# Altium schematic sheet MainSchem.SchDoc
size Tabloid
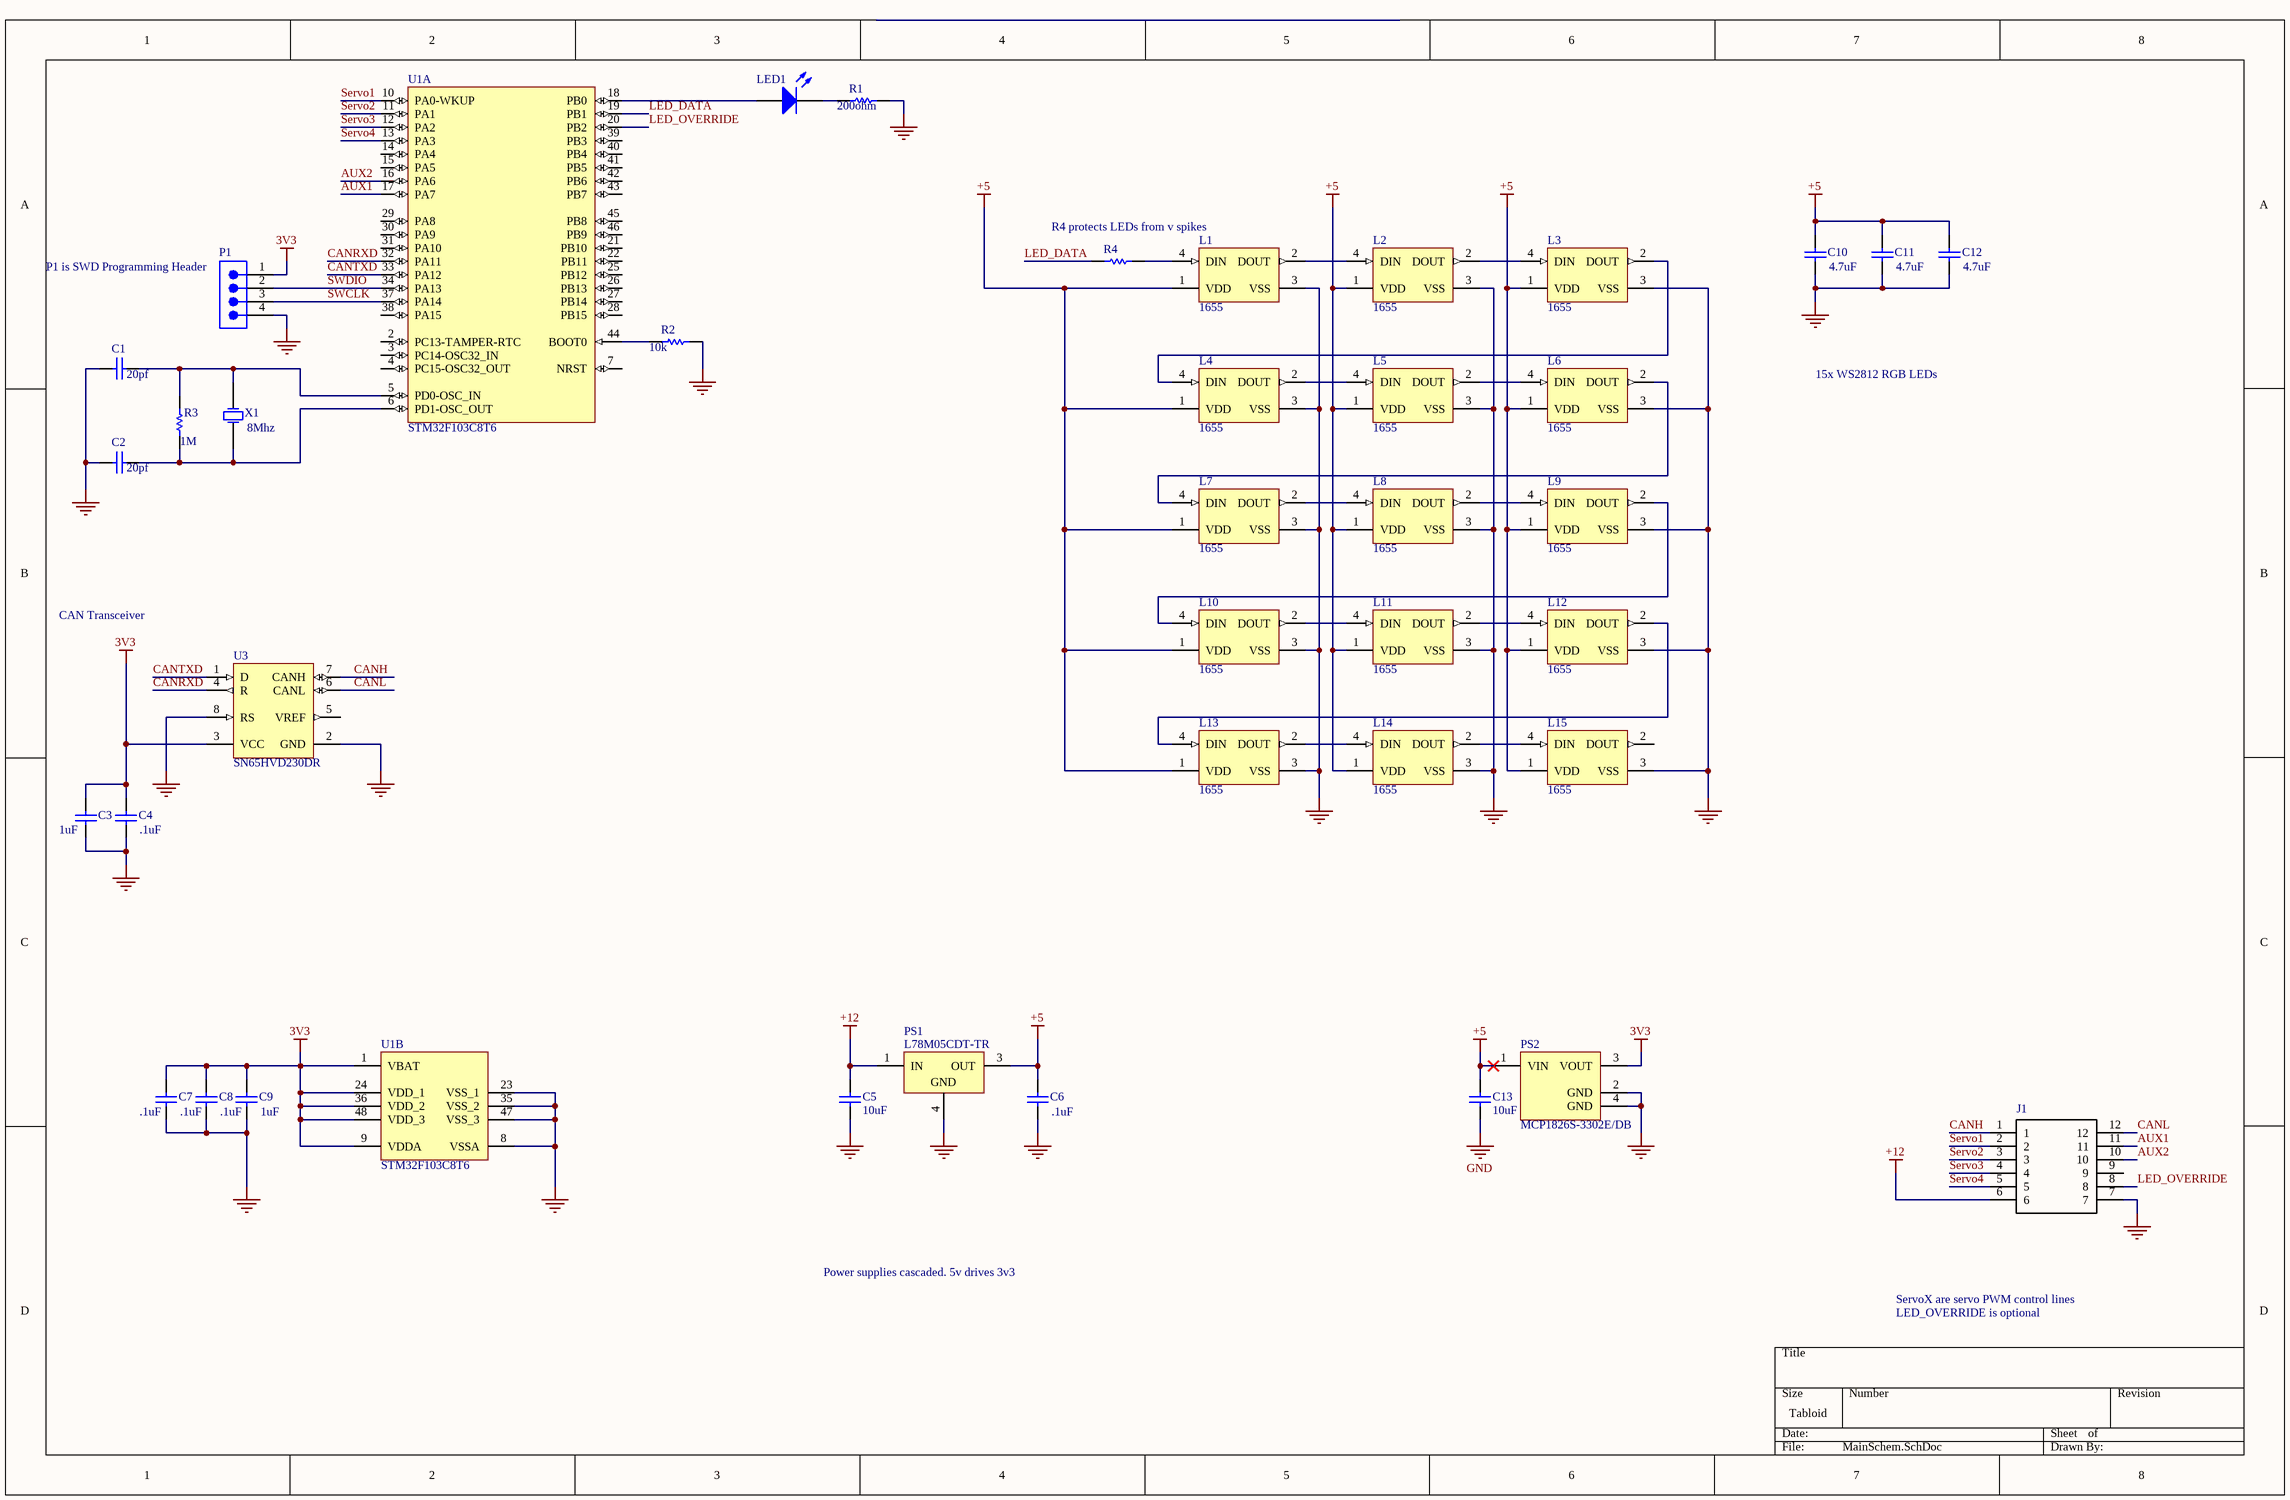
[diagram p0: MainSchem.SchDoc]

## Parts
C1  08051A200JAT2A  [CAPC2013X140X50NL20T25]  (value not drawn)
C2  08051A200JAT2A  [CAPC2013X140X50NL20T25]  (value not drawn)
C3  GRM31MR71H105KA88L  [CAPC3216X125X55LL15T25]  (value not drawn)
C4  12065C104KAT2A  [CAPC3216X94X50ML20T25]  (value not drawn)
C5  10uF  [MURA-1206_H_1.8_M]
C6  12065C104KAT2A  [CAPC3216X94X50ML20T25]  (value not drawn)
C7  12065C104KAT2A  [CAPC3216X94X50ML20T25]  (value not drawn)
C8  12065C104KAT2A  [CAPC3216X94X50ML20T25]  (value not drawn)
C9  12065C104KAT2A  [CAPC3216X94X50ML20T25]  (value not drawn)
C10  CGA6M3X7S2A475K200AB  [CAPC3225X220X20LL40]  (value not drawn)
C11  CGA6M3X7S2A475K200AB  [CAPC3225X220X20LL40]  (value not drawn)
C12  CGA6M3X7S2A475K200AB  [CAPC3225X220X20LL40]  (value not drawn)
C13  10uF  [MURA-1206_H_1.8_M]
J1  DTM13-12PA  [*TE_DTM13-12PA]  (value not drawn)
L1  1655  [ADA-RGB-1655_V]
L2  1655  [ADA-RGB-1655_V]
L3  1655  [ADA-RGB-1655_V]
L4  1655  [ADA-RGB-1655_V]
L5  1655  [ADA-RGB-1655_V]
L6  1655  [ADA-RGB-1655_V]
L7  1655  [ADA-RGB-1655_V]
L8  1655  [ADA-RGB-1655_V]
L9  1655  [ADA-RGB-1655_V]
L10  1655  [ADA-RGB-1655_V]
L11  1655  [ADA-RGB-1655_V]
L12  1655  [ADA-RGB-1655_V]
L13  1655  [ADA-RGB-1655_V]
L14  1655  [ADA-RGB-1655_V]
L15  1655  [ADA-RGB-1655_V]
LED1  150120GS75000  [1206_A]  (value not drawn)
P1  TSW-104-08-G-S  [SMTC-TSW-104-08-X-S]  (value not drawn)
PS1  L78M05CDT-TR  [TO-252_L]
PS2  MCP1826S-3302E/DB  [SOT-223-DB3_L]
R1  CRCW1206200RFKEA  [RESC3216X60X45ML10T20]  (value not drawn)
R2  CRCW120610K0FKEA  [RESC3216X60X45LL10T20]  (value not drawn)
R3  ERJ-8ENF1004V  [RESC3216X70X50NL05T20]  (value not drawn)
R4  ERJ8ENF3000V  [RESC3216X70X50NL05T20]  (value not drawn)
U1  STM32F103C8T6  [STM-LQFP48_L]  (parts A,B of 2)
U3  SN65HVD230DR  [D0008A_L]
X1  ABM3-8.000MHZ-D2Y-T  [ABRA-ABM3-2_V]  (value not drawn)

## Nets
3V3: C3.1 C4.1 C7.1 C8.1 C9.1 P1.1 PS2.3(VOUT) U1.1(VBAT) U1.9(VDDA) U1.24(VDD_1) U1.36(VDD_2) U1.48(VDD_3) U3.3(VCC)
+5: C6.1 C10.1 C11.1 C12.1 C13.1 L1.1(VDD) L2.1(VDD) L3.1(VDD) L4.1(VDD) L5.1(VDD) L6.1(VDD) L7.1(VDD) L8.1(VDD) L9.1(VDD) L10.1(VDD) L11.1(VDD) L12.1(VDD) L13.1(VDD) L14.1(VDD) L15.1(VDD) PS1.3(OUT) PS2.1(VIN)
+12: C5.1 J1.6 PS1.1(IN)
GND: C1.1 C2.1 C3.2 C4.2 C5.2 C6.2 C7.2 C8.2 C9.2 C10.2 C11.2 C12.2 C13.2 J1.7 L1.3(VSS) L2.3(VSS) L3.3(VSS) L4.3(VSS) L5.3(VSS) L6.3(VSS) L7.3(VSS) L8.3(VSS) L9.3(VSS) L10.3(VSS) L11.3(VSS) L12.3(VSS) L13.3(VSS) L14.3(VSS) L15.3(VSS) P1.4 PS1.4(GND) PS2.2(GND) PS2.4(GND) R1.2 R2.2 U1.8(VSSA) U1.23(VSS_1) U1.35(VSS_2) U1.47(VSS_3) U3.2(GND) U3.8(RS)
AUX1: J1.11 U1.17(PA7)
AUX2: J1.10 U1.16(PA6)
CANH: J1.1 U3.7(CANH)
CANL: J1.12 U3.6(CANL)
CANRXD: U1.32(PA11) U3.4(R)
CANTXD: U1.33(PA12) U3.1(D)
LED_DATA: R4.1 U1.19(PB1)
LED_OVERRIDE: J1.8 U1.20(PB2)
Servo1: J1.2 U1.10(PA0-WKUP)
Servo2: J1.3 U1.11(PA1)
Servo3: J1.4 U1.12(PA2)
Servo4: J1.5 U1.13(PA3)
SWCLK: P1.3 U1.37(PA14)
SWDIO: P1.2 U1.34(PA13)
NetC1_2: C1.2 R3.1 U1.5(PD0-OSC_IN) X1.1(X1)
NetC2_2: C2.2 R3.2 U1.6(PD1-OSC_OUT) X1.2(X2)
NetL1_2: L1.2(DOUT) L2.4(DIN)
NetL1_4: L1.4(DIN) R4.2
NetL2_2: L2.2(DOUT) L3.4(DIN)
NetL3_2: L3.2(DOUT) L4.4(DIN)
NetL4_2: L4.2(DOUT) L5.4(DIN)
NetL5_2: L5.2(DOUT) L6.4(DIN)
NetL6_2: L6.2(DOUT) L7.4(DIN)
NetL7_2: L7.2(DOUT) L8.4(DIN)
NetL8_2: L8.2(DOUT) L9.4(DIN)
NetL9_2: L9.2(DOUT) L10.4(DIN)
NetL10_2: L10.2(DOUT) L11.4(DIN)
NetL11_2: L11.2(DOUT) L12.4(DIN)
NetL12_2: L12.2(DOUT) L13.4(DIN)
NetL13_2: L13.2(DOUT) L14.4(DIN)
NetL14_2: L14.2(DOUT) L15.4(DIN)
NetLED1_1: LED1.1(K) R1.1
NetLED1_2: LED1.2(A) U1.18(PB0)
NetR2_1: R2.1 U1.44(BOOT0)

Not connected (* = marked no-connect by the designer): J1 9; L15 2(DOUT); U1 2(PC13-TAMPER-RTC) 3(PC14-OSC32_IN) 4(PC15-OSC32_OUT) 7(NRST) 14(PA4) 15(PA5) 21(PB10) 22(PB11) 25(PB12) 26(PB13) 27(PB14) 28(PB15) 29(PA8) 30(PA9) 31(PA10) 38(PA15) 39(PB3) 40(PB4) 41(PB5) 42(PB6) 43(PB7) 45(PB8) 46(PB9); U3 5(VREF)

## Notes on the sheet
- (near R1) 200ohm
- R4 protects LEDs from v spikes
- (near P1) P1 is SWD Programming Header
- 4.7uF
- (near C12) 4.7uF
- (near C1) 20pf
- (near R2) 10k
- 15x WS2812 RGB LEDs
- (near R3) 1M
- (near X1) 8Mhz
- (near C2) 20pf
- CAN Transceiver
- (near C3) 1uF
- (near C4) .1uF
- (near C7) .1uF
- (near C8) .1uF
- (near C9) .1uF
- (near C9) 1uF
- (near C6) .1uF
- Power supplies cascaded. 5v drives 3v3
- ServoX are servo PWM control lines
- LED_OVERRIDE is optional

## Library data of the parts
C1 C2 = CMP-2007-04537-1: Manufacturer: AVX Interconnect / Elco; Part Number: 08051A200JAT2A
C3 = CMP-2000-06356-1: Chip Capacitor, 1 uF, +/- 10%, 50 V, -55 to 125 degC, 1206 (3216 Metric), RoHS, Tape and Reel; Manufacturer: Murata; Case Width: 1.6mm; Dielectric: X7R; Case Length: 3.2mm; Case Height: 1.15mm; Voltage Rating DC: 50V; Capacitance: 1uF; Type: GeneralPurposeMLCC; Brand: MurataElectronics; Product: GeneralTypeMLCCs; Factory Pack Quantity: 3000; Packaging: Reel; Case Code - mm: 3216; Datasheet Version: 03/2016; Manufacturer URL: http://www.murata.com/; Tolerance: 10%; Case Code - in: 1206; Product Category: MultilayerCeramicCapacitorsMLCC-SMD/SMT; Series: GRM; Package Description: 2-Pin Surface Mount Device, Body 3.2 x 1.6 mm; Mounting Technology: SurfaceMount; Maximum Operating Temperature: +125C; RoHS: Details; Minimum Operating Temperature: -55C; Package Reference: 1206; Datasheet URL: http://search.murata.co.jp/Ceramy/image/img/A01X/G101/ENG/GRM31MR71H105KA88-01.pdf; Package / Case: 1206(3216metric); Termination Style: SMD/SMT
C4 C6-C9 = CMP-2000-05018-1: Chip Capacitor, Ceramic, 100 nF, 10%, 50 V, 1206, RoHS, Tape and Reel; Manufacturer: AVX; Rated Voltage: 50V; Dielectric: X7R; Capacitance: 100nF; Datasheet URL: http://www.mouser.com/ds/2/40/cauto-360.pdf; Manufacturer URL: http://www.avx.com/; Datasheet Version: Sep-14; Tolerance (%): ±10%; Case Size/Dimension: 1206
C5 C13 = CMP-2000-05256-1: CAP, Ceramic, 10 uF, 10%, 50 V, 1206, RoHS, Tape and Reel; Manufacturer: Murata; Dielectric: X5R; Case Height: 1.6mm; Type: GeneralPurposeMLCC; Voltage Rating DC: 50V; Brand: MurataElectronics; Case Length: 3.2mm; Case Code - mm: 3216; Manufacturer URL: http://www.murata.com/; Product: GeneralTypeMLCCs; RoHS: Details; Minimum Operating Temperature: -55C; Factory Pack Quantity: 2000; Maximum Operating Temperature: +85C; Case Width: 1.6mm; Series: GRM; Package / Case: 1206(3216metric); Tolerance: 10%; Capacitance: 10uF; Datasheet URL: http://download.siliconexpert.com/pdfs/2015/11/6/15/23/32/328/mrt_/manual/2905595417290350grm31cr61h106ka1223.pdf; Product Category: MultilayerCeramicCapacitorsMLCC-SMD/SMT; Packaging: Reel; Termination Style: SMD/SMT; Datasheet Version: Nov-15; Case Code - in: 1206
C10-C12 = CMP-2000-07583-1: Chip Capacitor, 4.7 uF, +/- 10%, 100 V, -55 to 125 degC, 1210 (3225 Metric), RoHS, Tape and Reel; Manufacturer: TDK; Capacitance: 4.7uF; Voltage Rating: 100V; Dielectric: X7S; Lead Free: LeadFree; Case/Package: 1210; REACH SVHC: NoSVHC; Radiation Hardening: No; Weight: 0.000564oz; Tolerance: 10%; Packaging: TapeandReel; Termination: SMD/SMT; Depth: 2.5mm; Datasheet URL: https://product.tdk.com/info/en/catalog/datasheets/mlcc_automotive_midvoltage_en.pdf; Package Reference: 3225; Package Quantity: 1; Min Operating Temperature: -55degC; RoHSCompliant: True; Height: 2mm; Case Code (Imperial): 1210; Case Code (Metric): 3225; Mounting Technology: SurfaceMount; Package Description: 2-Pin Surface Mount Device, Body 3.2 x 2.5 mm; Composition: Ceramic; Mount: SurfaceMount; Datasheet Version: 03/2015; Thickness: 0.087inch; Length: 3.2mm; Manufacturer URL: http://www.tdk.com/; Voltage Rating (DC): 100V; Max Operating Temperature: 125degC; Width: 0.098inch
J1 = DTM13-12PA: 12 way DTM13 A key Receptacle with PCB mount and 90 degree molded pins. Sealable, with centerline pitch .165 inch/4 millimeters. Gray.; MF: TE Connectivity; TE_purchase_URL: https://www.te.com/usa-en/product-DTM13-12PA.html?te_bu=Cor&te_type=disp&te_campaign=seda_glo_cor-seda-global-disp-prtnr-fy19-seda-model-bom-cta_sma-317_1&elqCampaignId=32493; Price: None; Package: None; SnapEDA_Link: https://www.snapeda.com/parts/DTM13-12PA/TE%20Connectivity%20Deutsch%20Connectors/view-part/?ref=snap; Availability: Unavailable; EU_RoHS_Compliance: Compliant; MP: DTM13-12PA; Value: *
L1-L15 = CMP-2000-05026-1: Intelligent Control LED Integrated Light Source, 3.5 to 5.3 V, -25 to 80 degC, 4-Pin SMD, RoHS, Tape and Reel; Manufacturer: Adafruit-Industries-LLC; Number of LEDs: 10; Configuration: Discrete; Utilized LED: WS2812(5050); Color: Red,Green,Blue(RGB); Datasheet URL: http://datasheet.octopart.com/ADA1655-Adafruit-Industries-datasheet-32028139.pdf; Series: Neopixel; Interface: -; Package Description: 4-Pin Surface Mount Device, Body 5 x 5 mm; Category: Optoelectronics; Controller Type: -; Package Reference: 1655; Manufacturer URL: https://www.adafruit.com/; Mounting Type: SurfaceMount; Datasheet Version: May-13; Size / Dimension: 5.00mmLx5.00mmW; Family: Addressable,Specialty
LED1 = CMP-1426-00014-1: SMD mono-color Chip LED, WL-SMCW, Green; Manufacturer: Wuerth Elektronik; PackageReference: 1206_A; PartNumber: 150120GS75000; ComponentLink1Description: Manufacturer URL; ComponentLink2URL: http://katalog.we-online.com/led/datasheet/150120GS75000.pdf; ComponentLink2Description: Datasheet; Color: Green; ComponentLink1URL: http://www.we-online.com
P1 = CMP-1024-00357-1: 0.025" SQ Post Header, Through-hole, Vertical, -55 to 125 degC, 2.54 mm Pitch, 4-Pin, Male, RoHS; Manufacturer: Samtec; Pitch: 2.54 mm; RoHS: True; ComponentLink3URL: http://www.samtec.com/documents/webfiles/cpdf/TSW-XXX-XX-XXX-X-XX-XXX-MKT.pdf; Mounting Technology: Through-hole; ComponentLink2URL: http://www.samtec.com/documents/webfiles/pdf/TSW_TH.PDF; ComponentLink1URL: http://www.samtec.com; ComponentLink3Description: Package Specification; PackageVersion: DM, 8/1988; ComponentLink2Description: Datasheet; PackageReference: TSW-104-08-X-S; PackageDescription: .025[0.64] SQ. Post Terminal Strip Assembly; PartNumber: TSW-104-08-G-S; ComponentLink1Description: Manufacturer URL; Temperature Range: -55 to 125 degC; DatasheetVersion: F-214; Orientation: Vertical
PS1 = CMP-0244-00178-1: Positive Voltage Regulator, 5V, 3-Pin DPAK, Tape and Reel; PackageReference: TO-252; ComponentLink1URL: http://www.st.com; ComponentLink2Description: Datasheet; PackageDescription: 3-Pin Transistor Outline Package 2.28 mm Pitch, 9.7 mm Lead Span (DPAK); ComponentLink1Description: Manufacturer URL; DatasheetVersion: 1/11/2010; ComponentLink2URL: http://www.st.com/internet/com/TECHNICAL_RESOURCES/TECHNICAL_LITERATURE/DATASHEET/CD00000447.pdf; PackageVersion: 2011
PS2 = CMP-0136-00504-1: 1000 mA, Low Voltage, Low Quiescent Current LDO Regulator, 3-Pin SOT-223, Extended Temperature; PackageVersion: revBB, Aug-2009; PackageReference: SOT-223-DB3; DatasheetVersion: revA, Aug-2007; PackageDescription: 3-Lead Plastic Small Outline Transistor (DB) [SOT-223]
R1 = CMP-2003-01935-1: Manufacturer: Vishay Dale; Part Number: CRCW1206200RFKEA
R2 = CMP-2003-04807-1: Manufacturer: Vishay Dale; Part Number: CRCW120610K0FKEA
R3 = CMP-2003-00020-1: Manufacturer: Panasonic; Part Number: ERJ-8ENF1004V
R4 = CMP-2003-00831-1: Manufacturer: Panasonic; Part Number: ERJ8ENF3000V
U1 = CMP-0237-00215-3: ARM Cortex-M3 32-bit MCU, 64 KB Flash, 20 KB Internal RAM, 37 I/Os, 48-pin LQFP, -40 to 85 degC, Tray; Supply Voltage(Vcc) min (V): 2; Internal RAM Size (kB): 20; FLASH Size (Prog) (kB): 64; A/D Converter: 2x12-bit (10 Channel); I/Os (High Current): 37; Operating Frequency(F) (Processor speed) (MHz): 72; Core: ARM Cortex-M3; ComponentLink3Description: Package Specification; Mounting Technology: Surface Mount; PartNumber: STM32F103C8T6; PackageReference: LQFP48; Packing: Tray; ComponentLink3URL: http://www.st.com/st-web-ui/static/active/en/resource/technical/document/datasheet/DM00058181.pdf; DatasheetVersion: Rev. 16; ComponentLink1URL: http://www.st.com/web/en/home.html; PackageVersion: Rev. 6, 06/2013; ComponentLink2URL: http://www.st.com/st-web-ui/static/active/en/resource/technical/document/datasheet/CD00161566.pdf; ComponentLink1Description: Manufacturer URL; ComponentLink2Description: Datasheet; PackageDescription: 48-Pin Low Profile Quad Flat Package, 7 x 7 mm Body, 0.5 mm Pitch
U3 = CMP-0315-00015-2: 3.3V CAN Transceiver with Standby Mode, 17 mA, -40 to 85 degC, 8-pin SOIC (D), Green (RoHS & no Sb/Br); Manufacturer: Texas Instruments; Rating: Catalog; Transient Pulse Protection(V): -25 to 25; Receivers Per Package: 1; ICC(Max)(mA): 17; Supply Voltage(s)(V): 3.3; Low Power Mode: Standby; Mounting Technology: Surface Mount; PackageReference: D0008A; Footprint: PCA82C250; ComponentLink1URL: http://www.ti.com/general/docs/lit/getliterature.tsp?genericPartNumber=SN65HVD230&fileType=pdf; Code_JEDEC: MS-012AA; ComponentLink1Description: Datasheet; Eco-Plan: Green (RoHS & no Sb/Br); PartNumber: SN65HVD230DR; PackageDescription: 8-Pin Plastic Small Outline Integrated Circuit, 4.9 x 3.9 mm, Pitch 1.27 mm Pitch; Isolated: No; DatasheetVersion: SLOS346K; PackageVersion: revM, Jun-2011; SubFamily: CAN; Drivers Per Package: 1
X1 = CMP-2000-05033-1: Miniature Ceramic Crystal, 8 MHz, -40 to 85 degC, 2-Pin SMD, RoHS, Tape and Reel; Manufacturer: ABRACON; Case Length: 5mm; Case Width: 3.2mm; Case Height: 1.3mm; Load Capacitance: 18pF; Frequency: 8MHz; Frequency Stability: 30PPM; ESR: 140Ohms; Tolerance: 20PPM; Type: MiniatureCeramicCrystal; Factory Pack Quantity: 1000; Package / Case: 5mmx3.2mm; Mounting Style: SMD/SMT; Manufacturer URL: http://www.abracon.com/; RoHS: Details; Dimensions: 3.2mmWx5mmLx1.3mmH; Datasheet URL: http://www.farnell.com/datasheets/1754353.pdf; Brand: ABRACON; Packaging: Reel; Product Category: Crystals; Package Description: 2-Pin Surface Mount Device, Body 5 x 3.2 mm; Package URL: http://www.abracon.com/Support/PackageDrawing/Resonators/ABM3.PDF; Operating Temperature Range: -40Cto+85C; Termination Style: SMD/SMT; Datasheet Version: Sep-13; Series: ABM3; Package Reference: ABM3-2